# EAGLE design Mozard Grounded Touch Pads (EAGLE 9.1.1)
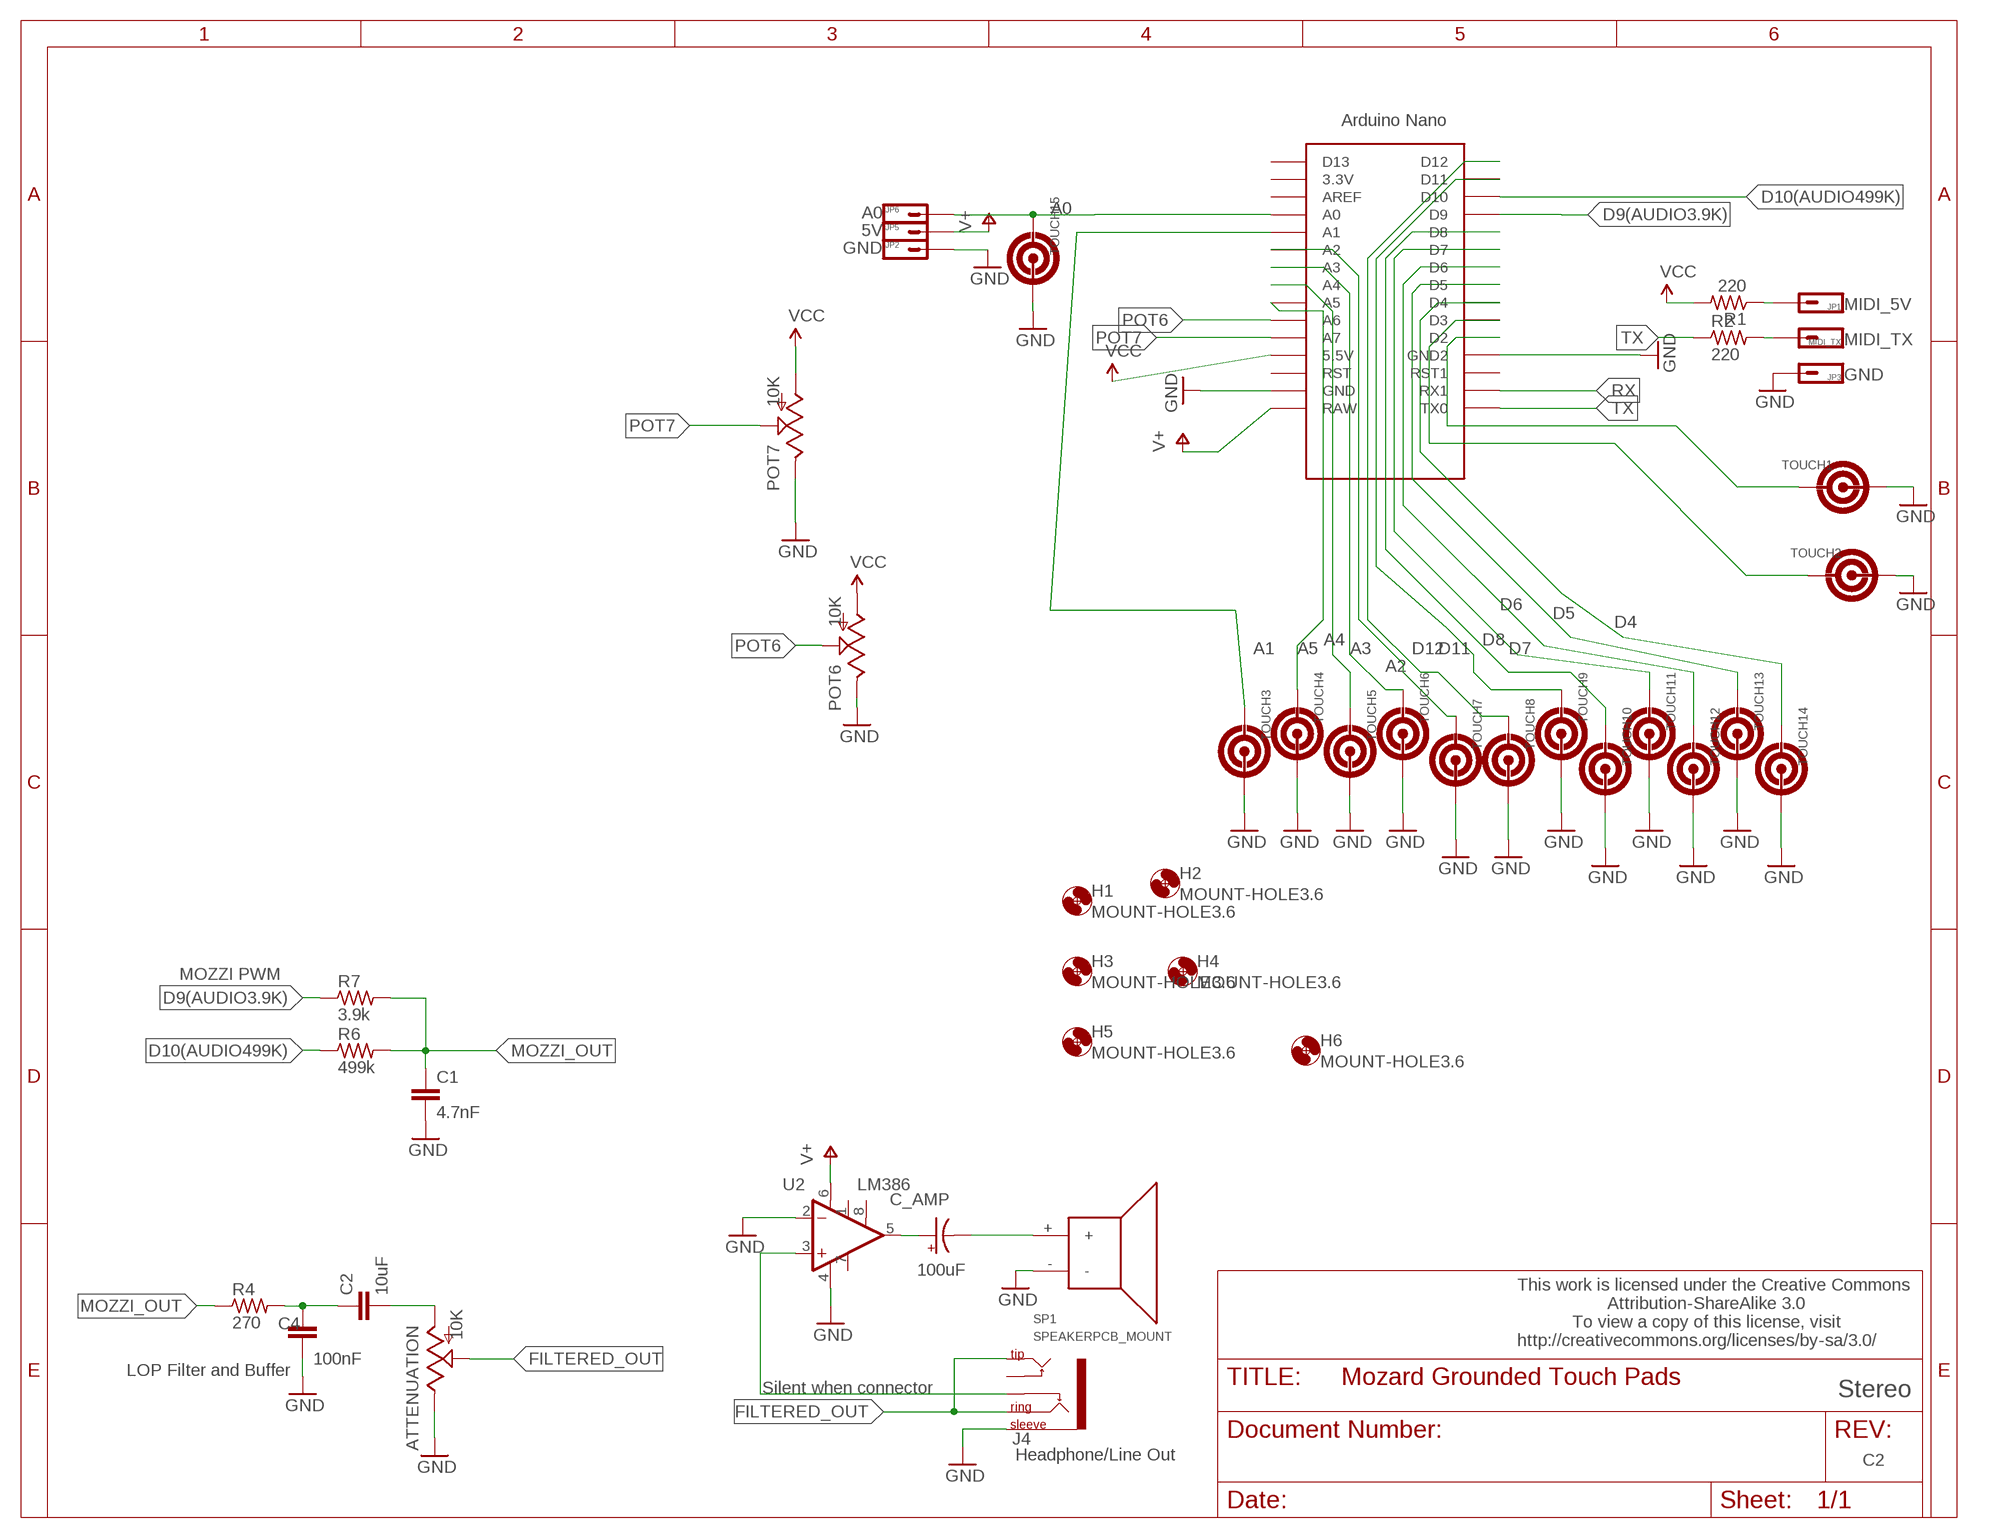
[diagram p0: schematic, sheet 1]

## Parts
ATTENUATION  10K  POTALPS-KIT  [ALPS_POT_KIT]
C1  4.7nF  0.1UF-50V-20%(PTH)KIT-EZ  [CAP-PTH-SMALL-KIT]
C2  10uF  0.1UF-50V-20%(PTH)KIT-EZ  [CAP-PTH-SMALL-KIT]
C4  100nF  0.1UF-50V-20%(PTH)KIT-EZ  [CAP-PTH-SMALL-KIT]
C_AMP  100uF  CPOL-RADIAL-10UF-25V  [CPOL-RADIAL-10UF-25V]
H1  MOUNT-HOLE3.6  [3,6]
H2  MOUNT-HOLE3.6  [3,6]
H3  MOUNT-HOLE3.6  [3,6]
H4  MOUNT-HOLE3.6  [3,6]
H5  MOUNT-HOLE3.6  [3,6]
H6  MOUNT-HOLE3.6  [3,6]
J4  Headphone/Line Out  AUDIO-JACKPTH  [AUDIO-JACK]
JP1  MIDI_5V  HEADER-1X1  [1X01_SIDE_NAME]
JP2  GND  HEADER-1X1  [1X01_SIDE_NAME]
JP3  GND  HEADER-1X1  [1X01_SIDE_NAME]
JP5  5V  HEADER-1X1  [1X01_SIDE_NAME]
JP6  A0  HEADER-1X1  [1X01_SIDE_NAME]
MIDI_TX  MIDI_TX  HEADER-1X1  [1X01_SIDE_NAME]
POT6  10K  POTALPS-KIT  [ALPS_POT_KIT]
POT7  10K  POTALPS-KIT  [ALPS_POT_KIT]
R1  220  R-US_0204/7  [0204/7]
R2  220  R-US_0204/7  [0204/7]
R4  270  R-US_0204/7  [0204/7]
R6  499k  R-US_0204/7  [0204/7]
R7  3.9k  R-US_0204/7  [0204/7]
SP1  SPEAKERPCB_MOUNT  [PCB_MOUNT_SPEAKER]
TOUCH1  PCB-TOUCHPAD2  [PCB-TOUCHPAD2]
TOUCH2  PCB-TOUCHPAD2  [PCB-TOUCHPAD2]
TOUCH3  PCB-TOUCHPAD2  [PCB-TOUCHPAD2]
TOUCH4  PCB-TOUCHPAD2  [PCB-TOUCHPAD2]
TOUCH5  PCB-TOUCHPAD2  [PCB-TOUCHPAD2]
TOUCH6  PCB-TOUCHPAD2  [PCB-TOUCHPAD2]
TOUCH7  PCB-TOUCHPAD2  [PCB-TOUCHPAD2]
TOUCH8  PCB-TOUCHPAD2  [PCB-TOUCHPAD2]
TOUCH9  PCB-TOUCHPAD2  [PCB-TOUCHPAD2]
TOUCH10  PCB-TOUCHPAD2  [PCB-TOUCHPAD2]
TOUCH11  PCB-TOUCHPAD2  [PCB-TOUCHPAD2]
TOUCH12  PCB-TOUCHPAD2  [PCB-TOUCHPAD2]
TOUCH13  PCB-TOUCHPAD2  [PCB-TOUCHPAD2]
TOUCH14  PCB-TOUCHPAD2  [PCB-TOUCHPAD2]
TOUCH15  PCB-TOUCHPAD2  [PCB-TOUCHPAD2]
U2  LM386  [DIP08]
U$1  NANO  [NANO]

## Nets
A0: JP6.1 TOUCH15.1 U$1.A0
A1: TOUCH3.1 U$1.A1
A2: TOUCH7.1 U$1.A2
A3: TOUCH6.1 U$1.A3
A4: TOUCH5.1 U$1.A4
A5: TOUCH4.1 U$1.A5
D4: TOUCH14.1 U$1.D4
D5: TOUCH13.1 U$1.D5
D6: TOUCH12.1 U$1.D6
D7: TOUCH11.1 U$1.D7
D8: TOUCH10.1 U$1.D8
D9(AUDIO3.9K): R7.1 U$1.D9
D10(AUDIO499K): R6.1 U$1.D10
D11: TOUCH9.1 U$1.D11
D12: TOUCH8.1 U$1.D12
FILTERED_OUT: ATTENUATION.P$2(S) J4.RING J4.TIP
GND: ATTENUATION.P$1(E) C1.2 C4.2 J4.SLEEVE JP2.1 JP3.1 POT6.P$1(E) POT7.P$1(E) SP1.- TOUCH1.2 TOUCH2.2 TOUCH3.2 TOUCH4.2 TOUCH5.2 TOUCH6.2 TOUCH7.2 TOUCH8.2 TOUCH9.2 TOUCH10.2 TOUCH11.2 TOUCH12.2 TOUCH13.2 TOUCH14.2 TOUCH15.2 U2.2(-IN) U2.4(V-) U$1.GND U$1.GND1(GND2)
MOZZI_OUT: C1.1 R4.1 R6.2 R7.2
N$1: C_AMP.- SP1.+
N$2: ATTENUATION.P$3(A) C2.2
N$3: JP1.1 R1.1
N$4: C2.1 C4.1 R4.2
N$5: MIDI_TX.1 R2.2
N$6: J4.RSH U2.3(+IN)
N$7: C_AMP.+ U2.5(OUT)
POT6: POT6.P$2(S) U$1.A6
POT7: POT7.P$2(S) U$1.A7
RX: U$1.RX1
TOUCH_A: TOUCH1.1 U$1.D2
TOUCH_B: TOUCH2.1 U$1.D3
TX: R2.1 U$1.TX0
V+: JP5.1 U2.6(V+) U$1.RAW
VCC: POT6.P$3(A) POT7.P$3(A) R1.2 U$1.5V(5.5V)
Unconnected: J4.TSH U2.1(GAIN) U2.7(BP) U2.8(GAIN) U$1.3.3V U$1.AREF U$1.D13 U$1.RST U$1.RST1

## Notes on the sheet
- MOZZI PWM
- This work is licensed under the Creative Commons
                    Attribution-ShareAlike 3.0
             To view a copy of this license, visit
  http://creativecommons.org/licenses/by-sa/3.0/
- LOP Filter and Buffer
- Silent when connector | Stereo
- C2

## Library data of the parts
ATTENUATION POT6 POT7 = SparkFun-Electromechanical:POT; PROD_ID: RES-09177
C1 C2 C4 = SparkFun-Capacitors:0.1UF-50V-20%(PTH): CAP-08370; PROD_ID: CAP-08370
C_AMP = Mitch-parts:CPOL-RADIAL-10UF-25V: Electrolytic Polarized
H1-H6 = holes:MOUNT-HOLE: MOUNTING HOLE with drill center marker
J4 = TOF:AUDIO-JACK: Stereo audio jack with bypass switches. SMT version used on LilyPad MP3 board.; PROD_ID: CONN-08774
JP1-JP3 JP5 JP6 MIDI_TX = TOF:HEADER-1X1: Header 1 Standard 1-pin 0.1" header. Use with straight break away headers (SKU : PRT-00116), right angle break away headers (PRT-00553), swiss pins (PRT-00743), machine pins (PRT-00117), and female headers (PRT-00115).
R1 R2 R4 R6 R7 = adafruit:R-US_: RESISTOR, American symbol
SP1 = SparkFun-Electromechanical:SPEAKER: General speakers.; MFG: SANCO; PROD_#: NA; SKU: COM-11089; SPARKLE_ID: 6504
TOUCH1-TOUCH15 = TOF:PCB-TOUCHPAD2: PCB resistive Touch-pad for touch-switch
U2 = Mitch-parts:LM386: low voltage audio power amplifier
U$1 = TOF:NANO: Arduino Nano

## Board
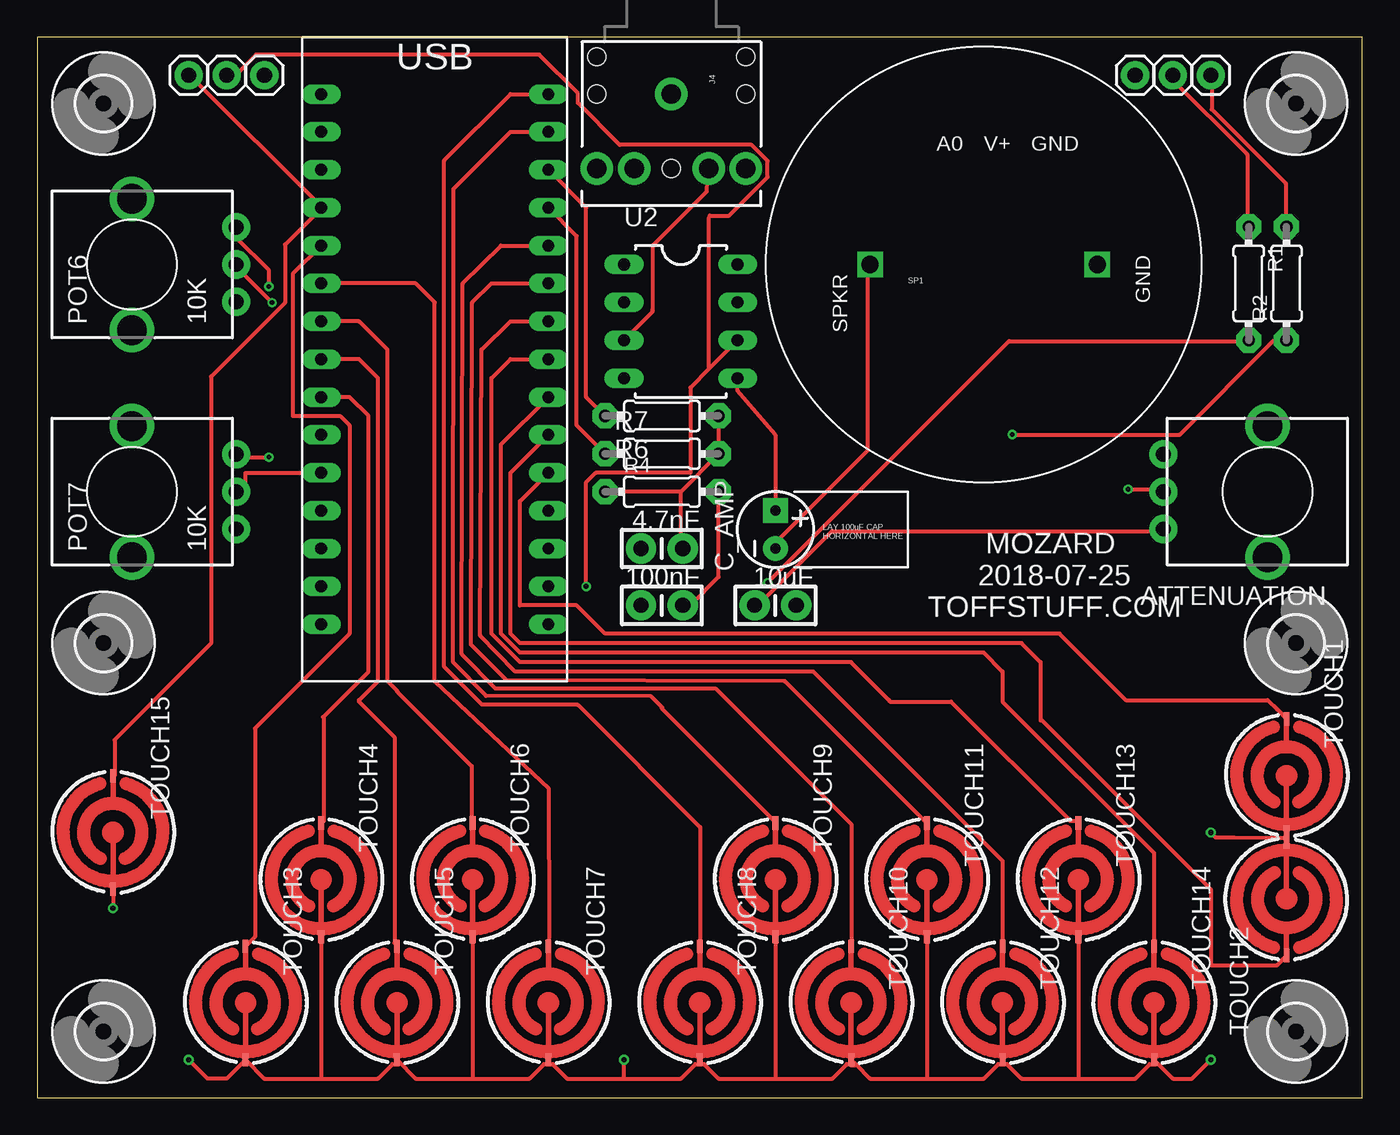
[diagram p1: board, top side]
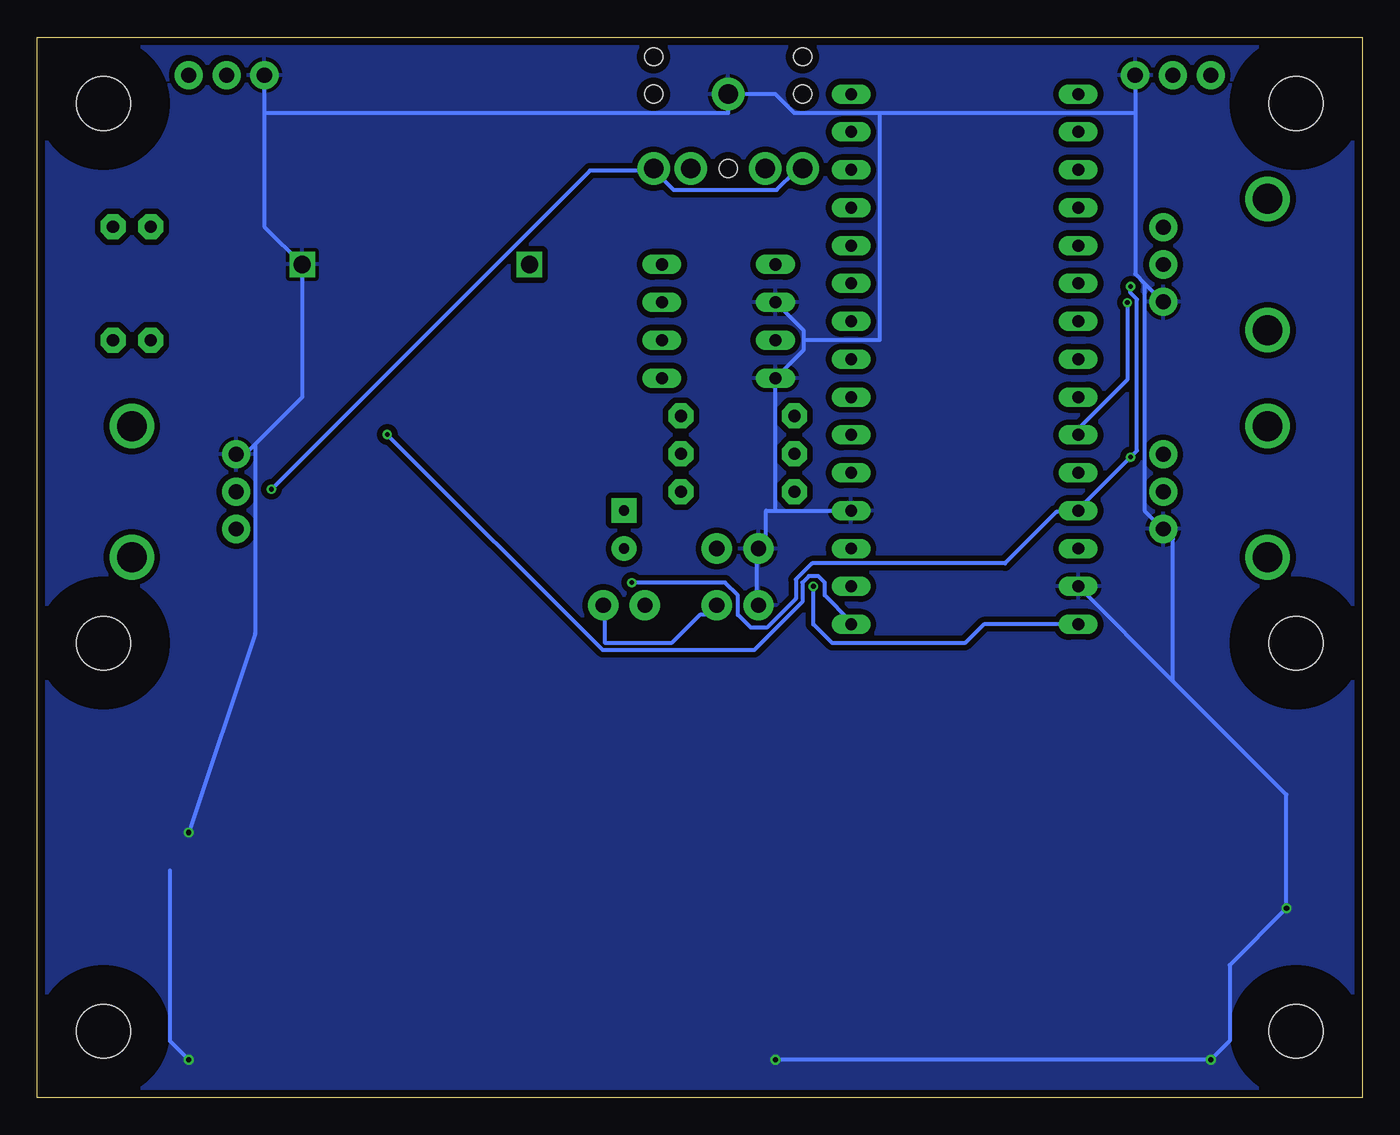
[diagram p2: board, bottom side, seen from below]

Size 88.9 x 71.12 mm. Coordinates in mm from the lower left corner, seen from the top.
Outline: 0,0 88.9,0 88.9,71.12 0,71.12 0,0
Copper layers (1*16): Top 0.035mm / dielectric 1.5mm / Bottom 0.035mm
Design rules "EagleRules *": minimum track width 10mil, minimum drill 12mil, track to track 7mil, track to pad 7mil, pad to pad 7mil, via to via 7mil, smd to smd 0mil, copper to edge 20mil, drill to drill 10mil, minimum pad ring 10mil, minimum via ring 6mil, stop-mask expansion 2mil, vias tented up to drill 25mil, thermal gap 10mil

### Footprints (pad centres in the part's own frame; a part is rotated, then mirrored left to right if it is on the bottom)
ALPS_POT_KIT = drill 1 pad 1.88: P$1 7,-2.5; P$2 7,0; P$3 7,2.5 | drill 2: P$4 0,-4.4; P$5 0,4.4
CAP-PTH-SMALL-KIT = drill 1.016 pad 2.032: 1 -1.397,0; 2 1.397,0
CPOL-RADIAL-10UF-25V = drill 0.7 pad 1.651 square: + 1.27,0 | drill 0.7 pad 1.651: - -1.27,0
3,6 = hole 3.6: 0,0
AUDIO-JACK = drill 1.3 pad 2.184: RING 5,5; RSH 5,2.5; SLEEVE 0,0; TIP 5,-5; TSH 5,-2.5 | hole 1.2: 0,5; -2.5,5; -2.5,-5; 0,-5; 5,0
1X01_SIDE_NAME = drill 1.016 pad 1.88: 1 0,0
0204/7 = drill 0.813 pad 1.676 octagon: 1 -3.81,0; 2 3.81,0
PCB_MOUNT_SPEAKER = drill 1.143 square: + -7.62,0; - 7.62,0
PCB-TOUCHPAD2 = smd 0.889 x 0.381: 1 -3.81,0; 2 3.81,0
DIP08 = drill 0.813 long: 1 -3.81,-3.81; 2 -1.27,-3.81; 3 1.27,-3.81; 4 3.81,-3.81; 5 3.81,3.81; 6 1.27,3.81; 7 -1.27,3.81; 8 -3.81,3.81
NANO = drill 0.8 long: 3.3V -7.62,15.24; 5V -7.62,-10.16; A0 -7.62,10.16; A1 -7.62,7.62; A2 -7.62,5.08; A3 -7.62,2.54; A4 -7.62,0; A5 -7.62,-2.54; A6 -7.62,-5.08; A7 -7.62,-7.62; AREF -7.62,12.7; D2 7.62,-7.62; D3 7.62,-5.08; D4 7.62,-2.54; D5 7.62,0; D6 7.62,2.54; D7 7.62,5.08; D8 7.62,7.62; D9 7.62,10.16; D10 7.62,12.7; D11 7.62,15.24; D12 7.62,17.78; D13 -7.62,17.78; GND -7.62,-15.24; GND1 7.62,-10.16; RAW -7.62,-17.78; RST -7.62,-12.7; RST1 7.62,-12.7; RX1 7.62,-15.24; TX0 7.62,-17.78

### Placement (x,y rotation side)
ATTENUATION  82.55,40.64 180 top
C1  41.91,36.83 180 top
C2  49.53,33.02 180 top
C4  41.91,33.02 180 top
C_AMP  49.53,38.1 90 top
H1  4.45,30.48 0 top
H2  4.45,66.67 0 top
H3  84.45,30.48 0 top
H4  84.45,66.67 0 top
H5  4.45,4.45 0 top
H6  84.45,4.45 0 top
J4  42.55,67.31 270 top
JP1  76.2,68.58 270 top
JP2  15.24,68.58 270 top
JP3  73.66,68.58 270 top
JP5  12.7,68.58 270 top
JP6  10.16,68.58 270 top
MIDI_TX  78.74,68.58 270 top
POT6  6.35,55.88 0 top
POT7  6.35,40.64 0 top
R1  81.28,54.61 270 top
R2  83.82,54.61 90 top
R4  41.91,40.64 0 top
R6  41.91,45.72 0 top
R7  41.91,43.18 0 top
SP1  63.5,55.88 0 top
TOUCH1  83.82,21.59 270 top
TOUCH2  83.82,13.34 90 top
TOUCH3  13.97,6.35 270 top
TOUCH4  19.05,14.61 270 top
TOUCH5  24.13,6.35 270 top
TOUCH6  29.21,14.61 270 top
TOUCH7  34.29,6.35 270 top
TOUCH8  44.45,6.35 270 top
TOUCH9  49.53,14.61 270 top
TOUCH10  54.61,6.35 270 top
TOUCH11  59.69,14.61 270 top
TOUCH12  64.77,6.35 270 top
TOUCH13  69.85,14.61 270 top
TOUCH14  74.93,6.35 270 top
TOUCH15  5.08,17.78 270 top
U2  43.18,52.07 270 top
U$1  26.67,49.53 0 top

### Tracks (layer width: path | path; a pad name or v marks a point on that pad's centre or on a via)
A0
  Top 0.254: TOUCH15.1 5.18,21.59 5.18,23.99 11.66,30.47 11.66,48.36 16.62,53.33 16.62,57.21 19,59.59 U$1.A0 19,59.8 10.36,68.44 JP6.1
A1
  Top 0.254: TOUCH3.1 14.61,10.79 14.61,24.77 20.95,31.11 20.95,45.09 20.32,45.72 17.14,45.72 17.14,55.24 U$1.A1
A2
  Top 0.254: U$1.A2 25.4,54.61 26.67,53.34 26.67,27.94 34.29,20.77 34.35,11.18 TOUCH7.1
A3
  Top 0.254: U$1.A3 21.59,52.07 23.5,50.16 23.5,27.94 24.13,27.3 24.18,27.2 29.15,22.24 29.15,18.57 TOUCH6.1
A4
  Top 0.254: U$1.A4 21.59,49.53 22.86,48.26 22.86,27.94 21.59,26.67 21.59,26.56 23.96,24.18 23.96,10.36 TOUCH5.1
A5
  Top 0.254: U$1.A5 20.95,46.99 22.23,45.72 22.23,28.57 19.17,25.52 19.21,25.48 19.21,18.57 TOUCH4.1
D4
  Top 0.254: U$1.D4 31.11,43.81 31.11,31.11 32.38,29.84 63.5,29.84 64.77,28.57 64.77,28.5 64.77,26.56 74.92,16.41 74.92,10.36 TOUCH14.1
D5
  Top 0.254: U$1.D5 31.75,49.53 30.48,48.26 30.48,31.11 32.38,29.21 54.61,29.21 57.15,26.67 57.21,26.56 61.32,26.56 69.3,18.57 69.74,18.57 TOUCH13.1
D6
  Top 0.254: U$1.D6 31.75,52.07 29.8,50.16 29.73,31 32.07,28.57 52.03,28.57 52.07,28.57 64.77,15.88 64.77,15.76 64.77,10.36 TOUCH12.1
D7
  Top 0.254: U$1.D7 30.48,54.61 29.18,53.34 29.11,30.38 31.5,27.98 50.16,27.93 50.16,27.94 TOUCH11.1 59.59,18.57
D8
  Top 0.254: U$1.D8 31.11,57.15 28.54,54.61 28.48,29.75 30.73,27.43 45.47,27.43 45.55,27.42 54.62,18.35 54.62,10.36 TOUCH10.1
D9(AUDIO3.9K)
  Top 0.254: U$1.D9 36.2,57.78 36.2,45.09 R7.1
D10(AUDIO499K)
  Top 0.254: U$1.D10 36.83,59.69 36.83,46.99 R6.1
D11
  Top 0.254: U$1.D11 31.75,64.77 27.93,60.96 27.92,29.19 30.1,26.95 41.2,26.91 41.93,26.17 41.88,26.12 49.44,18.57 TOUCH9.1
D12
  Top 0.254: U$1.D12 31.75,67.31 27.3,62.87 27.3,28.89 29.84,26.35 36.2,26.35 36.27,26.34 44.48,18.14 44.48,10.36 TOUCH8.1
FILTERED_OUT  (via drill 0.3)
  Top 0.254: v73.19,40.8 75.35,40.8 ATTENUATION.P$2
  Bottom 0.254: v73.19,40.8 51.82,62.18 47.71,62.18 J4.RING 47.5,62.18 46.2,60.88 39.29,60.88 38,62.18 37.57,62.18 J4.TIP
GND  (via drill 0.35)
  Top 0.254: 19.05,1.27 15.24,1.27 TOUCH3.2 12.7,1.27 11.43,1.27 v10.16,2.54 | 19.05,1.27 22.86,1.27 23.84,2.25 24.13,2.25 | TOUCH5.2 25.4,1.27 29.21,1.27 | 29.21,1.27 33.02,1.27 34,2.25 34.29,2.25 | 39.37,1.27 35.56,1.27 34.58,2.25 34.29,2.25 | 39.37,1.27 43.18,1.27 44.16,2.25 44.45,2.25 | 44.74,2.25 45.72,1.27 49.53,1.27 | 49.53,1.27 53.34,1.27 54.32,2.25 54.61,2.25 54.62,2.16 54.84,2.16 54.91,2.23 | 44.45,2.25 44.74,2.25 | TOUCH10.2 54.91,2.23 | 54.91,2.23 55.88,1.27 59.69,1.27 | 59.69,1.27 63.5,1.27 64.48,2.25 64.77,2.25 | 65.06,2.25 66.04,1.27 69.85,1.27 | 69.85,1.27 73.66,1.27 74.64,2.25 74.93,2.25 | 64.77,2.25 65.06,2.25 | TOUCH9.2 49.53,1.27 | TOUCH6.2 29.21,1.27 | TOUCH4.2 19.05,1.27 | TOUCH11.2 59.69,1.27 | TOUCH13.2 69.85,1.27 | TOUCH15.2 v5.08,12.7 | TOUCH14.2 76.2,1.27 77.47,1.27 v78.74,2.54 | 39.37,1.27 v39.37,2.54 | 65.06,2.25 64.77,2.25 | TOUCH12.2 64.77,2.25 | 44.74,2.25 44.45,2.25 | TOUCH8.2 44.45,2.25 | TOUCH7.2 34.29,2.25 | v78.74,17.78 79.06,17.46 80.31,17.46 82.82,17.44 83.82,17.44 | 83.82,17.44 83.82,17.49 83.82,17.44 | TOUCH2.2 83.82,17.44 | TOUCH1.2 83.82,17.44
  Bottom 0.254: v78.74,2.54 80.01,3.81 80.01,15.24 | JP3.1 73.66,66.04 | 73.66,66.04 73.66,58.42 SP1.- 71.12,46.99 74.3,43.81 | 74.3,43.81 74.93,43.18 ATTENUATION.P$1 | v78.74,17.78 74.3,31.11 74.3,43.81 | v39.37,2.54 v10.16,2.54 8.89,3.81 8.89,8.89 v5.08,12.7 5.08,20.32 12.7,27.94 | 12.7,27.94 U$1.GND | 12.7,27.94 12.7,37.47 13.34,38.1 POT7.P$1 13.97,38.73 14.61,39.37 14.61,54.61 | 39.37,39.37 40.01,39.37 40.01,36.83 C1.2 40.64,36.83 40.64,33.02 C4.2 | 39.37,39.37 U$1.GND1 | 39.37,39.37 U2.4 37.47,50.16 37.47,50.8 | U2.2 37.47,51.44 37.47,50.8 | 14.61,54.61 15.24,55.24 15.24,66.04 | 14.61,54.61 13.97,53.98 POT6.P$1 | JP2.1 15.24,66.04 | 15.24,66.04 32.38,66.04 | 32.38,66.04 38.1,66.04 39.37,67.31 J4.SLEEVE 42.55,66.04 73.66,66.04 | 37.47,50.8 32.38,50.8 32.38,66.04
  pour Bottom (isolate 0.381): 0,71.12 88.9,71.12 88.9,0 0,0
MOZZI_OUT
  Top 0.254: R6.2 R7.2 43.18,40.64 | 43.18,40.64 R4.1 | 43.18,40.64 43.18,36.83 C1.1
N$1
  Top 0.254: C_AMP.- 49.66,36.92 49.66,37.35 55.7,43.4 55.7,55.7 SP1.+
N$2
  Top 0.254: ATTENUATION.P$3 75.35,38 53.33,38 48.15,32.82 C2.2
N$3
  Top 0.254: R1.1 81.18,58.51 81.18,63.26 76,68.44 JP1.1
N$4
  Top 0.254: R4.2 45.72,34.92 43.81,33.02 C4.1
  Bottom 0.254: C2.1 50.8,33.02 50.8,30.48 46.35,30.48 44.45,32.38 43.81,32.38 43.18,33.02 C4.1
N$5
  Top 0.254: R2.2 83.77,58.51 83.77,61.32 78.8,66.28 78.8,68.44 MIDI_TX.1
N$6
  Top 0.254: U2.3 41.27,52.7 41.27,52.82 41.27,57.14 44.94,60.78 45,62.19 | 45,62.19 45.01,62.31 | J4.RSH 45.12,62.18 45,62.19
N$7
  Top 0.254: C_AMP.+ 49.53,44.45 46.99,47.41 U2.5
POT6  (via drill 0.3)
  Top 0.254: v15.76,53.33 13.39,55.7 POT6.P$2
  Bottom 0.254: v15.76,53.33 15.76,48.15 19,44.91 19,44.48 U$1.A6
POT7
  Top 0.254: U$1.A7 13.97,41.91 13.97,40.64 POT7.P$2
TOUCH_A
  Top 0.254: U$1.D2 32.38,40.01 32.38,33.02 36.2,33.02 38.1,31.11 68.58,31.11 73.03,26.67 82.55,26.67 83.19,26.04 TOUCH1.1
TOUCH_B
  Top 0.254: U$1.D3 31.75,41.91 31.75,31.11 32.38,30.48 66.04,30.48 67.31,29.21 67.31,25.4 | 67.31,25.4 67.31,25.3 | TOUCH2.1 83.19,8.89 78.74,8.89 78.74,13.97 67.31,25.4
TX  (via drill 0.3)
  Top 0.254: v65.42,44.48 76.64,44.48 82.91,50.74 83.77,50.74 R2.1
  Bottom 0.254: v65.42,44.48 50.95,30.01 40.8,30.01 37.57,33.25 37.57,34.54 37.13,34.98 36.49,34.98 36.05,34.54 36.05,33.68 34.33,31.95 U$1.TX0
V+  (via drill 0.35)
  Top 0.254: U2.6 45.09,48.9 | 45.09,48.9 43.81,47.62 43.81,41.91 37.47,41.91 36.83,41.27 v36.83,34.29 | 45.09,48.9 45.09,59.05 45.12,59.16 46.42,59.16 49.01,61.75 49.01,62.83 47.93,63.91 39.08,63.91 36.27,66.71 36.27,67.36 33.68,69.95 14.68,69.95 13.39,68.66 12.74,68.66 JP5.1
  Bottom 0.254: U$1.RAW 25.4,31.75 26.67,30.48 35.56,30.48 36.83,31.75 v36.83,34.29
VCC  (via drill 0.3)
  Top 0.254: v15.54,42.96 13.39,42.96 POT7.P$3 | v49.01,34.54 65.2,50.74 81.18,50.74 R1.2 | v15.54,54.41 15.54,55.49 13.39,57.65 13.39,58.29 POT6.P$3
  Bottom 0.254: v49.01,34.54 42.75,34.54 41.88,33.68 41.88,32.38 41.02,31.52 39.94,31.52 38,33.47 38,34.76 36.92,35.84 23.96,35.84 20.51,39.29 19.21,39.29 U$1.5V 19,39.51 v15.54,42.96 15.11,43.4 15.11,53.54 15.54,53.98 v15.54,54.41

### Text on the board
tPlace: A0 | V+ | GND | GND | SPKR | MOZARD / 2018-07-25 / TOFFSTUFF.COM | LAY 100uF CAP / HORIZONTAL HERE